# Altium schematic sheet VT 12S LHS V0.1.SchDoc
size A4; SheetNumber: 1; SheetTotal: 1
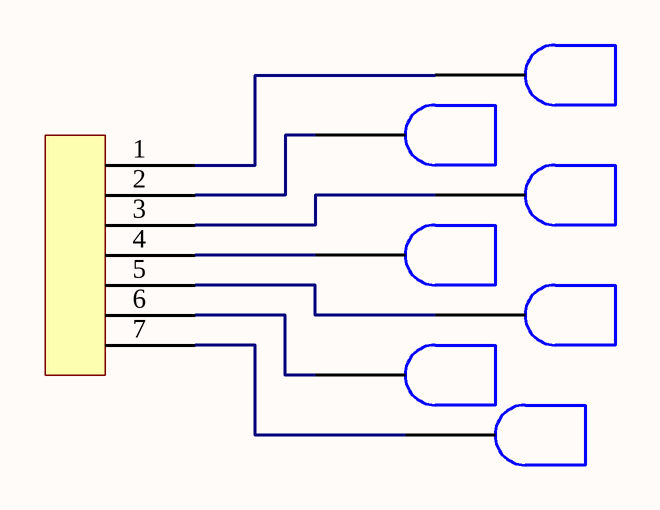
[diagram p0: VT 12S LHS V0.1.SchDoc]

## Parts
J1  Voltage Tap  [Voltage Tap]  (value not drawn)  (no BOM)
J2  Voltage Tap  [Voltage Tap]  (value not drawn)  (no BOM)
J3  Voltage Tap  [Voltage Tap]  (value not drawn)  (no BOM)
J4  Voltage Tap  [Voltage Tap]  (value not drawn)  (no BOM)
J5  Voltage Tap  [Voltage Tap]  (value not drawn)  (no BOM)
J6  84953-7-FPC  [84953-7 - FPC]  (value not drawn)  (no BOM)
J7  Voltage Tap  [Voltage Tap]  (value not drawn)  (no BOM)
J8  Voltage Tap  [Voltage Tap]  (value not drawn)  (no BOM)

## Nets
NetJ1_1: J1.1 J6.1
NetJ2_1: J2.1 J6.2
NetJ3_1: J3.1 J6.3
NetJ4_1: J4.1 J6.4
NetJ5_1: J5.1 J6.5
NetJ6_6: J6.6 J7.1
NetJ6_7: J6.7 J8.1

## Library data of the parts
J6 = 84953-7-FPC: FPC Connectors, Flex-to-Board, 7 Position, .039 in [1 mm] Centerline, FPC Side Connector